# Altium schematic sheet SIM800C SCH.SchDoc
size A3; SheetNumber: 2; SheetTotal: 2
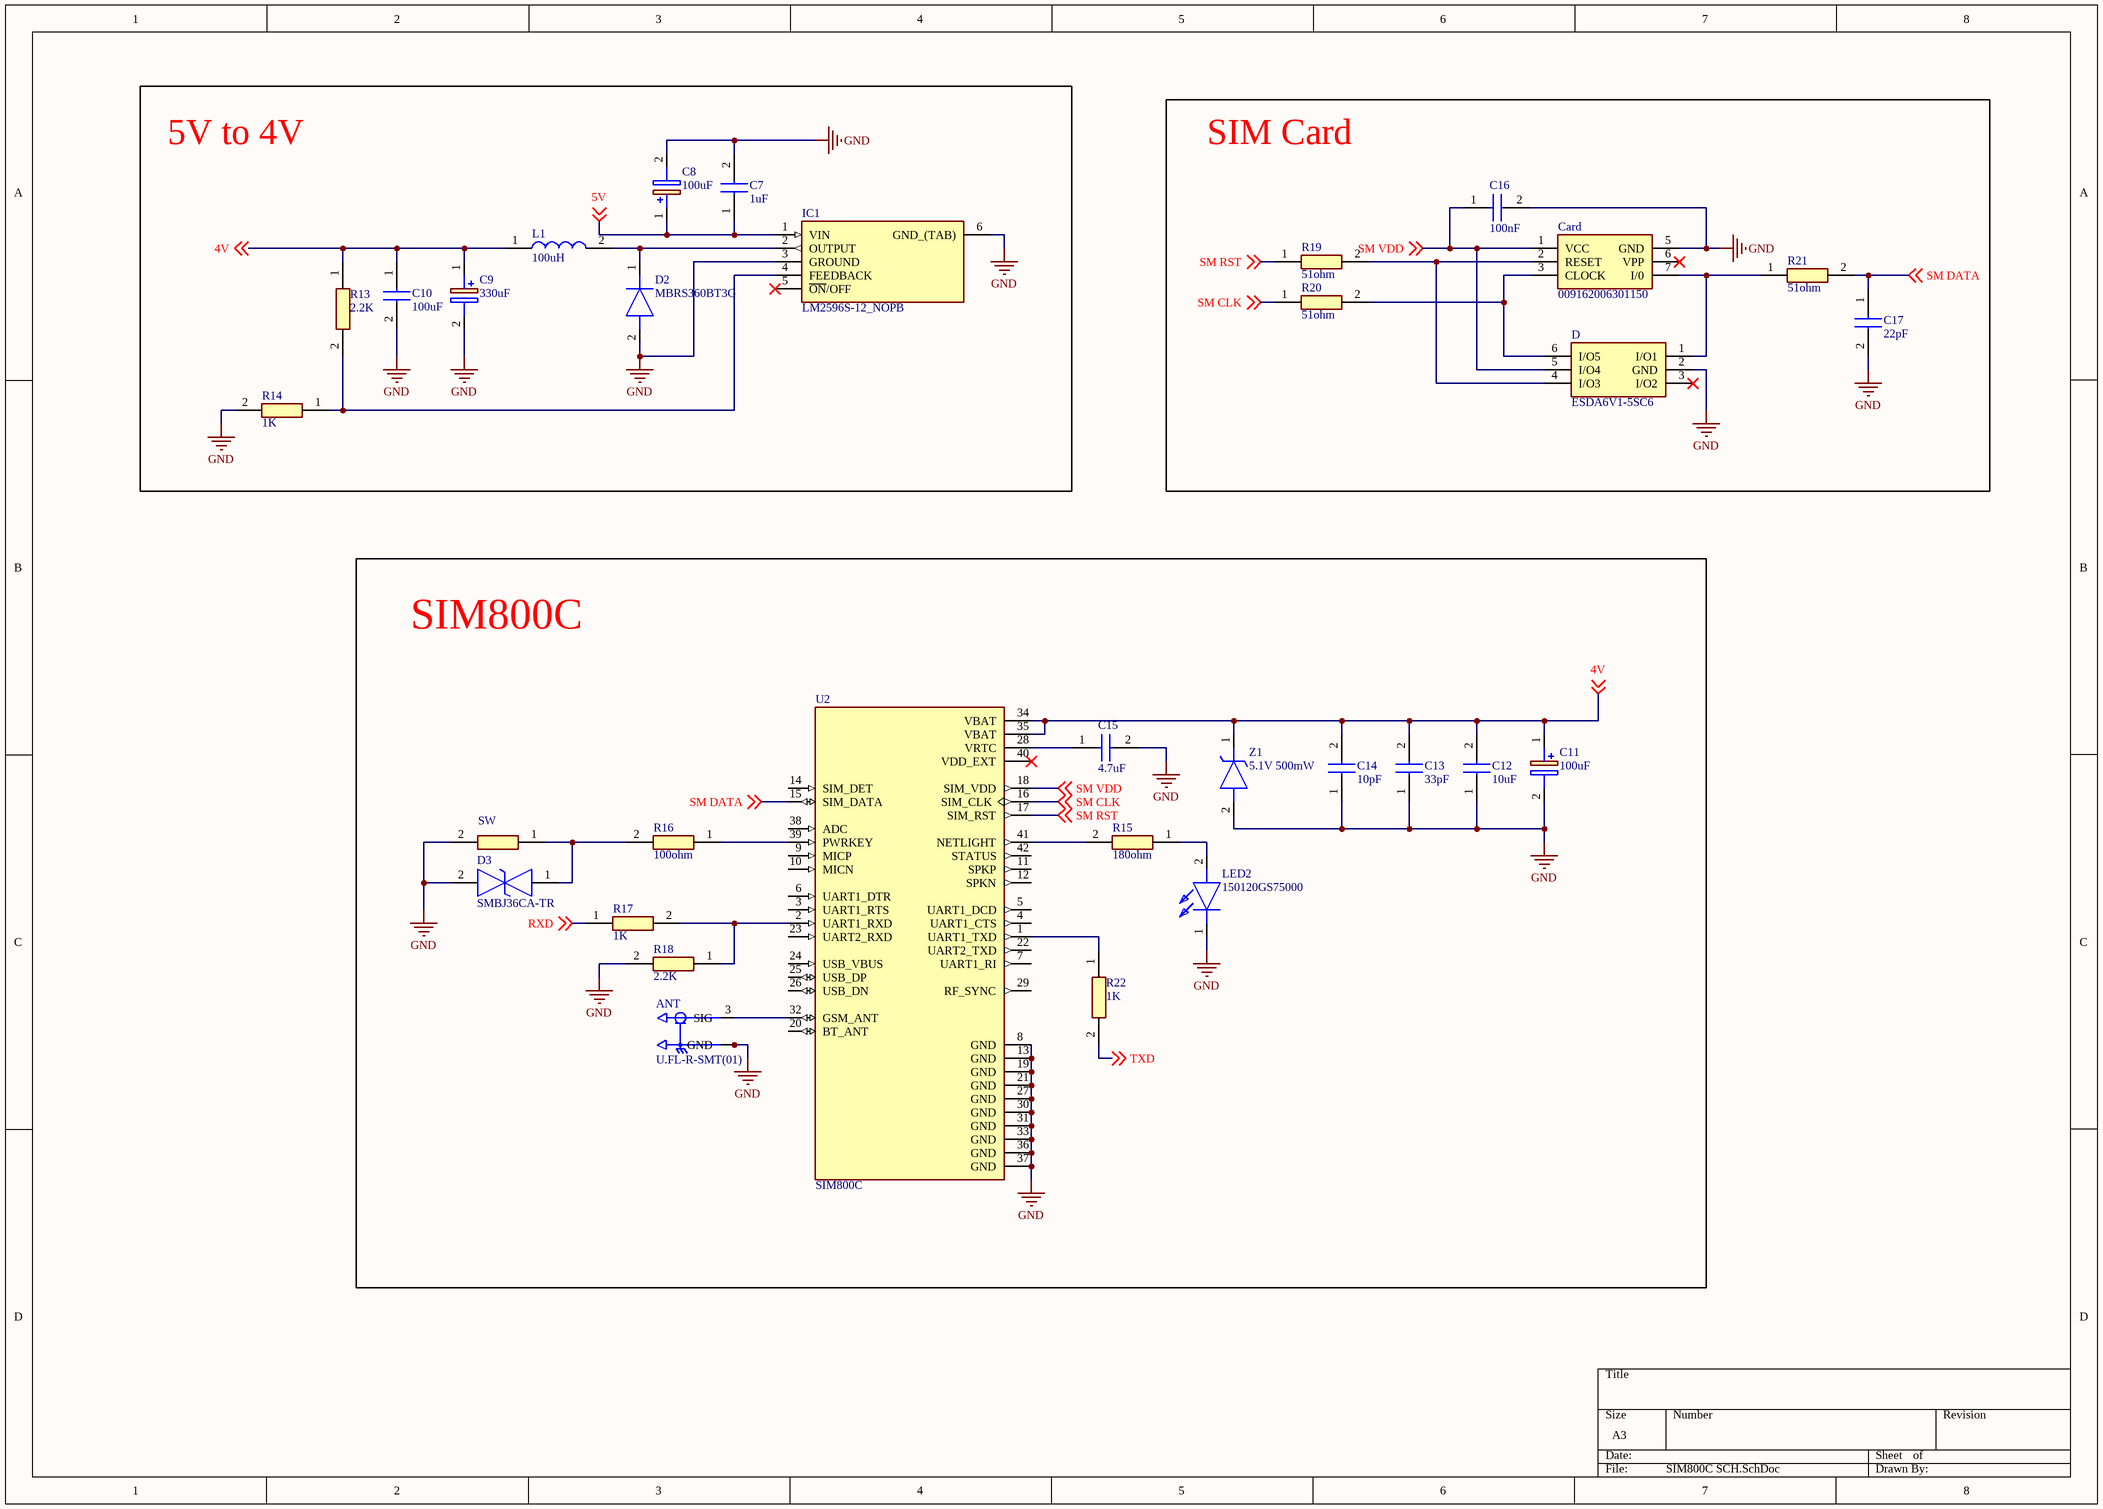
[diagram p0: SIM800C SCH.SchDoc]

## Parts
ANT  U.FL-R-SMT(01)  [HRS_U.FL-R-SMT(01)]
C7  1uF  [CAPC3216X127N]
C8  100uF  [CAPAE660X800N]
C9  330uF  [EEETC1V470P]
C10  100uF  [CAPC3216X127N]
C11  100uF  [T510E]
C12  10uF  [CAPC3216X127N]
C13  33pF  [CAPC3216X127N]
C14  10pF  [CAPC3216X127N]
C15  4.7uF  [CAPC3216X127N]
C16  100nF  [CAPC3216X127N]
C17  22pF  [CAPC3216X170N]
Card  009162006301150  [009162006301150]
D  ESDA6V1-5SC6  [SOT95P280X145-6N]
D2  MBRS360BT3G  [DIOM5436X247N]
D3  SMBJ36CA-TR  [SMBJ50CA]
IC1  LM2596S-12_NOPB  [TO170P1435X465-6N]
L1  100uH  [RLH0912101KL]
LED2  150120GS75000  [LEDC3214X78N]
R13  2.2K  [RESC3216X51N]
R14  1K  [RESC3216X51N]
R15  180ohm  [RESC3216X51N]
R16  100ohm  [RESC3216X51N]
R17  1K  [RESC3216X51N]
R18  2.2K  [RESC3216X51N]
R19  51ohm  [RESC3216X60N]
R20  51ohm  [RESC3216X60N]
R21  51ohm  [RESC3216X60N]
R22  1K  [RESC3216X51N]
SW  PHPA1206E1001BST1  [RESC3216X51N]  (value not drawn)
U2  SIM800C  [LCC110P1570X1760X250-42N]
Z1  5.1V 500mW  [SOD3716X135N]

## Blocks framed on the sheet
5V to 4V: C7-C10 D2 IC1 L1 R13 R14
SIM Card: C16 C17 Card D R19-R21
SIM800C: ANT C11-C15 D3 LED2 R15-R18 R22 SW U2 Z1

## Nets
GND: ANT.1(GND) ANT.2(GND) C7.2 C8.2(-) C9.2(-) C10.2 C11.2(-) C12.1 C13.1 C14.1 C15.2 C16.2 C17.2 Card.5(GND) D.2(GND) D2.2(A) D3.2 IC1.3(GROUND) IC1.6(GND_(TAB)) LED2.1(K) R14.2 R18.2 SW.2 U2.8(GND) U2.13(GND) U2.19(GND) U2.21(GND) U2.27(GND) U2.30(GND) U2.31(GND) U2.33(GND) U2.36(GND) U2.37(GND) Z1.2(A)
4V: C9.1(+) C10.1 C11.1(+) C12.2 C13.2 C14.2 L1.1 R13.1 U2.34(VBAT) U2.35(VBAT) Z1.1(K) ; off-sheet 4V
5V: C7.1 C8.1(+) IC1.1(VIN) ; off-sheet 5V
RXD: R17.1 ; off-sheet RXD
SM CLK: R20.1 U2.16(SIM_CLK) ; off-sheet SM CLK
SM DATA: C17.1 R21.2 U2.15(SIM_DATA) ; off-sheet SM DATA
SM RST: R19.1 U2.17(SIM_RST) ; off-sheet SM RST
SM VDD: C16.1 Card.1(VCC) D.5(I/O4) U2.18(SIM_VDD) ; off-sheet SM VDD
TXD: R22.2 ; off-sheet TXD
NetANT_3: ANT.3(SIG) U2.32(GSM_ANT)
NetC15_1: C15.1 U2.28(VRTC)
NetCard_2: Card.2(RESET) D.4(I/O3) R19.2
NetCard_3: Card.3(CLOCK) D.6(I/O5) R20.2
NetCard_7: Card.7(I/0) D.1(I/O1) R21.1
NetD2_1: D2.1(K) IC1.2(OUTPUT) L1.2
NetD3_1: D3.1 R16.2 SW.1
NetIC1_4: IC1.4(FEEDBACK) R13.2 R14.1
NetLED2_2: LED2.2(A) R15.1
NetR15_2: R15.2 U2.41(NETLIGHT)
NetR16_1: R16.1 U2.39(PWRKEY)
NetR17_2: R17.2 R18.1 U2.2(UART1_RXD)
NetR22_1: R22.1 U2.1(UART1_TXD)

Not connected (* = marked no-connect by the designer): Card 6(VPP)*; D 3(I/O2)*; IC1 5(~{ON}/OFF)*; U2 3(UART1_RTS) 4(UART1_CTS) 5(UART1_DCD) 6(UART1_DTR) 7(UART1_RI) 9(MICP) 10(MICN) 11(SPKP) 12(SPKN) 14(SIM_DET) 20(BT_ANT) 22(UART2_TXD) 23(UART2_RXD) 24(USB_VBUS) 25(USB_DP) 26(USB_DN) 29(RF_SYNC) 38(ADC) 40(VDD_EXT)* 42(STATUS)

## Library data of the parts
ANT = U.FL-R-SMT(01): U.FL (UMCC) Connector Receptacle, Male Pin 50Ohm Surface Mount Solder. RF Connectors / Coaxial Connectors; MF: Hirose; Check_prices: https://www.snapeda.com/parts/U.FL-R-SMT(01)/Hirose+Electric+Co+Ltd/view-part/?ref=eda; Value: *; Availability: In Stock; MP: U.FL-R-SMT(01); Price: None; Package: None; SnapEDA_Link: https://www.snapeda.com/parts/U.FL-R-SMT(01)/Hirose+Electric+Co+Ltd/view-part/?ref=snap; Purchase-URL: https://pricing.snapeda.com/search/part/U.FL-R-SMT(01)/?ref=eda
C7 C15 = 1206YC105JAT2A: Capacitor; Manufacturer_Name: AVX; Datasheet Link: https://spicat.kyocera-avx.com/product/mlcc/chartview/1206YC105JAT2A/DataSheet/X7R; Height: 1.27mm; Manufacturer_Part_Number: 1206YC105JAT2A; Mouser Part Number: 581-1206YC105J; Mouser Price/Stock: https://www.mouser.com/Search/Refine.aspx?Keyword=581-1206YC105J; Arrow Part Number: 1206YC105JAT2A; Arrow Price/Stock: https://www.arrow.com/en/products/1206yc105jat2a/avx
C8 = EEV107M025A9HAA: 100uF 25VDC 20% Capacitor Polarised; Manufacturer_Name: KEMET; Datasheet Link: https://content.kemet.com/datasheets/KEM_A4002_EEV.pdf; Height: 8mm; Manufacturer_Part_Number: EEV107M025A9HAA; Mouser Part Number: 80-EEV107M025A9HAA; Mouser Price/Stock: https://www.mouser.co.uk/ProductDetail/KEMET/EEV107M025A9HAA?qs=T9vdlufmP8y%2FxeVsq9Rq6w%3D%3D; Arrow Part Number: EEV107M025A9HAA; Arrow Price/Stock: https://www.arrow.com/en/products/eev107m025a9haa/kemet-corporation?region=nac
C9 = EEE-FH1E331UL: 330uF 20% tolerance 25VDC Capacitor Polarised; Manufacturer_Name: Panasonic; Datasheet Link: https://industrial.panasonic.com/cdbs/www-data/pdf/RDE0000/ast-ind-166561.pdf; Manufacturer_Part_Number: EEE-FH1E331UL
C10 = 1206YC105JAT2A: 100uF 10% tolerance 10VDC Capacitor; Manufacturer_Name: AVX; Datasheet Link: https://spicat.kyocera-avx.com/product/mlcc/chartview/1206YC105JAT2A/DataSheet/X7R; Height: 1.27mm; Manufacturer_Part_Number: 1206YC105JAT2A; Mouser Part Number: 581-1206YC105J; Mouser Price/Stock: https://www.mouser.com/Search/Refine.aspx?Keyword=581-1206YC105J; Arrow Part Number: 1206YC105JAT2A; Arrow Price/Stock: https://www.arrow.com/en/products/1206yc105jat2a/avx
C11 = T510E107M025ATE050: 100uF 25VDC Capacitor Polarised; Manufacturer_Name: KEMET; Datasheet Link: https://content.kemet.com/datasheets/KEM_T2014_T510.pdf; Height: 4.3mm; Manufacturer_Part_Number: T510E107M025ATE050; Mouser Part Number: 80-T510E107M025; Mouser Price/Stock: https://www.mouser.co.uk/ProductDetail/KEMET/T510E107M025ATE050?qs=WjQheL5Mt%2FDzPcz8%252Buuowg%3D%3D; Arrow Part Number: T510E107M025ATE050; Arrow Price/Stock: https://www.arrow.com/en/products/t510e107m025ate050/kemet-corporation?region=nac
C12 = 1206YC105JAT2A: 10uF 25VDC Capacitor; Manufacturer_Name: AVX; Datasheet Link: https://spicat.kyocera-avx.com/product/mlcc/chartview/1206YC105JAT2A/DataSheet/X7R; Height: 1.27mm; Manufacturer_Part_Number: 1206YC105JAT2A; Mouser Part Number: 581-1206YC105J; Mouser Price/Stock: https://www.mouser.com/Search/Refine.aspx?Keyword=581-1206YC105J; Arrow Part Number: 1206YC105JAT2A; Arrow Price/Stock: https://www.arrow.com/en/products/1206yc105jat2a/avx
C13 = 1206YC105JAT2A: 33pF 50VDC Capacitor; Manufacturer_Name: AVX; Datasheet Link: https://spicat.kyocera-avx.com/product/mlcc/chartview/1206YC105JAT2A/DataSheet/X7R; Height: 1.27mm; Manufacturer_Part_Number: 1206YC105JAT2A; Mouser Part Number: 581-1206YC105J; Mouser Price/Stock: https://www.mouser.com/Search/Refine.aspx?Keyword=581-1206YC105J; Arrow Part Number: 1206YC105JAT2A; Arrow Price/Stock: https://www.arrow.com/en/products/1206yc105jat2a/avx
C14 = 1206YC105JAT2A: 10pF 50VDC Capacitor; Manufacturer_Name: AVX; Datasheet Link: https://spicat.kyocera-avx.com/product/mlcc/chartview/1206YC105JAT2A/DataSheet/X7R; Height: 1.27mm; Manufacturer_Part_Number: 1206YC105JAT2A; Mouser Part Number: 581-1206YC105J; Mouser Price/Stock: https://www.mouser.com/Search/Refine.aspx?Keyword=581-1206YC105J; Arrow Part Number: 1206YC105JAT2A; Arrow Price/Stock: https://www.arrow.com/en/products/1206yc105jat2a/avx
C16 = 1206YC105JAT2A: 100nF 10% tolerance 50VDC Capacitor; Manufacturer_Name: AVX; Datasheet Link: https://spicat.kyocera-avx.com/product/mlcc/chartview/1206YC105JAT2A/DataSheet/X7R; Height: 1.27mm; Manufacturer_Part_Number: 1206YC105JAT2A; Mouser Part Number: 581-1206YC105J; Mouser Price/Stock: https://www.mouser.com/Search/Refine.aspx?Keyword=581-1206YC105J; Arrow Part Number: 1206YC105JAT2A; Arrow Price/Stock: https://www.arrow.com/en/products/1206yc105jat2a/avx
C17 = VJ1206A220JXGAT5Z: 22pF 10% tolerance 50VDC tolerance Capacitor; Manufacturer_Name: Vishay; Datasheet Link: http://www.vishay.com/docs/45200/vjhirelseries.pdf; Height: 1.7mm; Manufacturer_Part_Number: VJ1206A220JXGAT5Z; Mouser Part Number: 77-VJ1206A220JXGAT5Z; Mouser Price/Stock: https://www.mouser.co.uk/ProductDetail/Vishay-Vitramon/VJ1206A220JXGAT5Z?qs=UulECF1yA9GP5yydc6Uoow%3D%3D
Card = 009162006301150: Connector; Manufacturer_Name: AVX; Datasheet Link: http://datasheets.avx.com/LockingSIM_9162-300.pdf; Height: 2.5mm; Manufacturer_Part_Number: 009162006301150; Mouser Part Number: 581-009162006301150; Mouser Price/Stock: https://www.mouser.co.uk/ProductDetail/AVX/009162006301150?qs=3oXjESXZBsBVgHb8Ltya2A%3D%3D; Arrow Part Number: 009162006301150; Arrow Price/Stock: https://www.arrow.com/en/products/009162006301150/avx
D = ESDA6V1-5SC6: Integrated Circuit; Manufacturer_Name: STMicroelectronics; Datasheet Link: http://www.st.com/st-web-ui/static/active/en/resource/technical/document/datasheet/CD00005102.pdf; Height: 1.45mm; Manufacturer_Part_Number: ESDA6V1-5SC6; Mouser Part Number: 511-ESDA6V1-5SC6; Mouser Price/Stock: https://www.mouser.co.uk/ProductDetail/STMicroelectronics/ESDA6V1-5SC6?qs=ZN9SVtODT3yxqNpCUKP6Bg%3D%3D; Arrow Part Number: ESDA6V1-5SC6; Arrow Price/Stock: https://www.arrow.com/en/products/esda6v1-5sc6/stmicroelectronics?region=nac
D2 = MBRS360BT3G: Schottky Diodes & Rectifiers 60V,Schottky,SMA,3A; Manufacturer_Name: onsemi; Datasheet Link: http://www.onsemi.com/pub/Collateral/MBRS360T3-D.PDF; Height: 2.47mm; Manufacturer_Part_Number: MBRS360BT3G; Mouser Part Number: 863-MBRS360BT3G; Mouser Price/Stock: https://www.mouser.co.uk/ProductDetail/onsemi/MBRS360BT3G?qs=S9Eyls9TyKbavyAAp37J%252Bg%3D%3D; Arrow Part Number: MBRS360BT3G; Arrow Price/Stock: https://www.arrow.com/en/products/mbrs360bt3g/on-semiconductor
D3 = SMBJ36CA-TR: TVS Diode (Bi-directional) - SMBJ22A; Manufacturer_Name: STMicroelectronics; Datasheet Link: http://uk.rs-online.com/web/p/products/7958492; Height: 2.65mm; Manufacturer_Part_Number: SMBJ36CA-TR; Mouser Part Number: 511-SMBJ36CA-TR; Mouser Price/Stock: https://www.mouser.co.uk/ProductDetail/STMicroelectronics/SMBJ36CA-TR?qs=SoAZXCQuyY%252BvVRKvkB14ug%3D%3D; Arrow Part Number: SMBJ36CA-TR; Arrow Price/Stock: https://www.arrow.com/en/products/smbj36ca-tr/stmicroelectronics?region=europe
IC1 = LM2596S-12_NOPB: Integrated Circuit; Manufacturer_Name: Texas Instruments; Manufacturer_Part_Number: LM2596S-12/NOPB; Datasheet Link: http://www.ti.com/lit/ds/symlink/lm2596.pdf; Height: 4.65mm; Mouser Part Number: 926-LM2596S-12/NOPB; Mouser Price/Stock: https://www.mouser.co.uk/ProductDetail/Texas-Instruments/LM2596S-12-NOPB?qs=X1J7HmVL2ZF8LB%2FmfveaIg%3D%3D; Arrow Part Number: LM2596S-12/NOPB; Arrow Price/Stock: https://www.arrow.com/en/products/lm2596s-12nopb/texas-instruments?region=nac
L1 = RLH0912-101KL: 100uH 10% tolerance 900mA Inductor; Manufacturer_Name: Bourns; Datasheet Link: https://www.google.com/url?sa=t&rct=j&q=&esrc=s&source=web&cd=&ved=2ahUKEwjz1aCsps70AhWJ3oUKHQXqBgMQFnoECA0QAQ&url=https%3A%2F%2Fwww.bourns.com%2Fpdfs%2Frlb.pdf&usg=AOvVaw0e0GPLRrDgk_KnlxXDz6FJ; Height: 11mm; Manufacturer_Part_Number: RLH0912-101KL; Mouser Part Number: 652-RLH0912-101KL; Mouser Price/Stock: https://www.mouser.co.uk/ProductDetail/Bourns/RLH0912-101KL?qs=SUrgTEU5cSrf3ut5JjToyw%3D%3D
LED2 = 150120GS75000: LED; Manufacturer_Name: Wurth Elektronik; Height: 0.78mm; Manufacturer_Part_Number: 150120GS75000; Mouser Part Number: 710-150120GS75000; Mouser Price/Stock: https://www.mouser.co.uk/ProductDetail/Wurth-Elektronik/150120GS75000?qs=LlUlMxKIyB3I3AMxrmBw4A%3D%3D
R13 R18 = PHPA1206E1001BST1: 2.2K 1% tolerance Resistor; Manufacturer_Name: Vishay; Datasheet Link: https://www.vishay.com/docs/60160/phpa.pdf; Height: 0.508mm; Manufacturer_Part_Number: PHPA1206E1001BST1; Mouser Part Number: 71-PHPA1206E1001BST1; Mouser Price/Stock: https://www.mouser.co.uk/ProductDetail/Vishay-Thin-Film/PHPA1206E1001BST1?qs=QNEnbhJQKvai8SEWbiX%2FTw%3D%3D
R14 R17 R22 = PHPA1206E1001BST1: 1K 1% tolerance Resistor; Manufacturer_Name: Vishay; Datasheet Link: https://www.vishay.com/docs/60160/phpa.pdf; Height: 0.508mm; Manufacturer_Part_Number: PHPA1206E1001BST1; Mouser Part Number: 71-PHPA1206E1001BST1; Mouser Price/Stock: https://www.mouser.co.uk/ProductDetail/Vishay-Thin-Film/PHPA1206E1001BST1?qs=QNEnbhJQKvai8SEWbiX%2FTw%3D%3D
R15 = PHPA1206E1001BST1: 180ohm 1% tolerance Resistor; Manufacturer_Name: Vishay; Datasheet Link: https://www.vishay.com/docs/60160/phpa.pdf; Height: 0.508mm; Manufacturer_Part_Number: PHPA1206E1001BST1; Mouser Part Number: 71-PHPA1206E1001BST1; Mouser Price/Stock: https://www.mouser.co.uk/ProductDetail/Vishay-Thin-Film/PHPA1206E1001BST1?qs=QNEnbhJQKvai8SEWbiX%2FTw%3D%3D
R16 = PHPA1206E1001BST1: 100ohm 1% tolerance Resistor; Manufacturer_Name: Vishay; Datasheet Link: https://www.vishay.com/docs/60160/phpa.pdf; Height: 0.508mm; Manufacturer_Part_Number: PHPA1206E1001BST1; Mouser Part Number: 71-PHPA1206E1001BST1; Mouser Price/Stock: https://www.mouser.co.uk/ProductDetail/Vishay-Thin-Film/PHPA1206E1001BST1?qs=QNEnbhJQKvai8SEWbiX%2FTw%3D%3D
R19-R21 = CRCW120651R0FKEAC: 51ohm 1% tolerance Resistor; Manufacturer_Name: Vishay; Datasheet Link: http://componentsearchengine.com/Datasheets/1/CRCW120651R0FKEAC.pdf; Height: 0.6mm; Manufacturer_Part_Number: CRCW120651R0FKEAC; Mouser Part Number: 71-CRCW120651R0FKEAC; Mouser Price/Stock: https://www.mouser.co.uk/ProductDetail/Vishay-Dale/CRCW120651R0FKEAC?qs=E3Y5ESvWgWOS4uisdbRXsg%3D%3D; Arrow Part Number: CRCW120651R0FKEAC; Arrow Price/Stock: https://www.arrow.com/en/products/crcw120651r0fkeac/vishay?region=nac
SW = PHPA1206E1001BST1: 2 Pin switch; Manufacturer_Name: Vishay; Datasheet Link: https://www.vishay.com/docs/60160/phpa.pdf; Height: 0.508mm; Manufacturer_Part_Number: PHPA1206E1001BST1; Mouser Part Number: 71-PHPA1206E1001BST1; Mouser Price/Stock: https://www.mouser.co.uk/ProductDetail/Vishay-Thin-Film/PHPA1206E1001BST1?qs=QNEnbhJQKvai8SEWbiX%2FTw%3D%3D
U2 = SIM800C: Module: GSM/Bluetooth; GPRS; 2G; 1800MHz, 900MHz; 85.6kbps; SMD; MF: Simcom; Check_prices: https://www.snapeda.com/parts/SIM800C/SIMcom+Wireless+solutions+Co.%252CLtd/view-part/?ref=eda; Value: *; Availability: In Stock; MP: SIM800C; Price: None; Package: None; SnapEDA_Link: https://www.snapeda.com/parts/SIM800C/SIMcom+Wireless+solutions+Co.%252CLtd/view-part/?ref=snap
Z1 = MMSZ5231C-E3-08: Zener Diode 5.1V 500mW; Manufacturer_Name: Vishay; Datasheet Link: https://www.arrow.com/en/products/mmsz5231c-e3-08/vishay; Height: 1.35mm; Manufacturer_Part_Number: MMSZ5231C-E3-08; Mouser Part Number: 78-MMSZ5231C-E3-08; Mouser Price/Stock: https://www.mouser.co.uk/ProductDetail/Vishay-Semiconductors/MMSZ5231C-E3-08?qs=S660mHfF5o35EDHKMfkp8w%3D%3D; Arrow Part Number: MMSZ5231C-E3-08; Arrow Price/Stock: https://www.arrow.com/en/products/mmsz5231c-e3-08/vishay